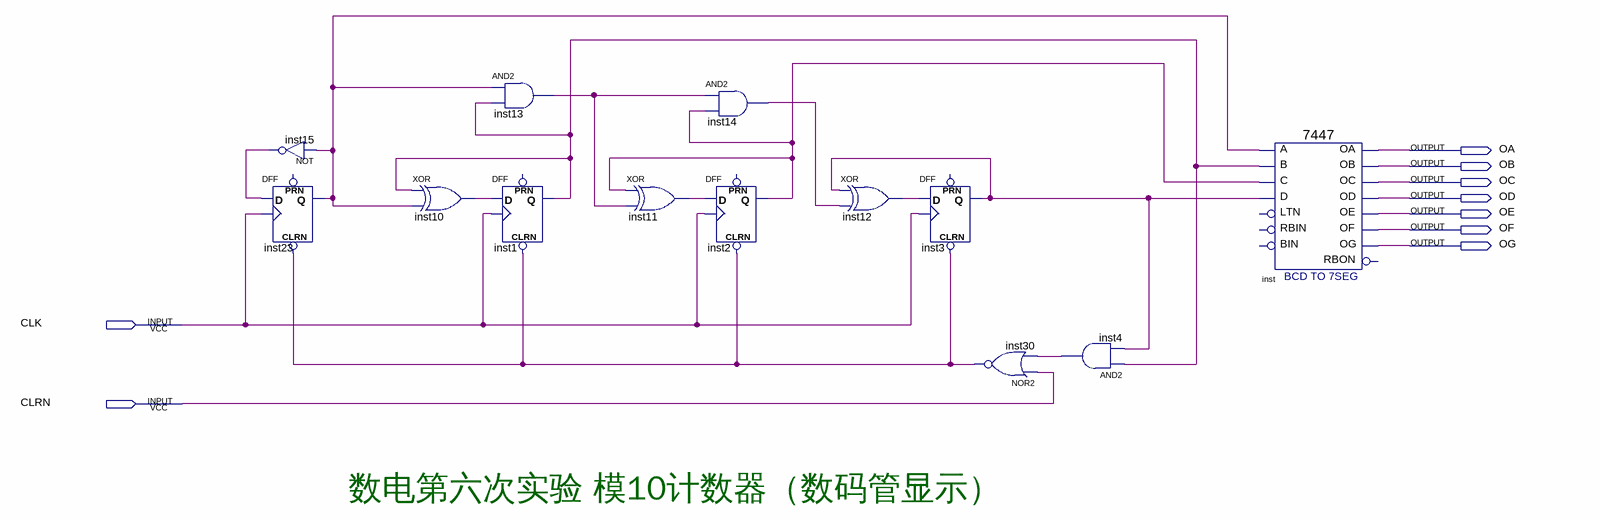
[diagram p0: schematic sheet]
// Quartus schematic DECjishuqi.bdf as structural Verilog: 13 symbols, 9 pins
module DECjishuqi (
  input  CLK,
  input  CLRN,
  output OA,
  output OB,
  output OC,
  output OD,
  output OE,
  output OF,
  output OG
);

  wire inst1_q, inst2_q, inst3_q, inst4_out, inst10_out, inst11_out, inst12_out, inst13_out, inst14_out,
       inst15_out, inst23_q, inst30_out;

  not inst15 (inst15_out, inst23_q);
  DFF inst23 (.CLRN(inst30_out), .CLK(CLK), .D(inst15_out), .Q(inst23_q));  // open: PRN
  xor inst10 (inst10_out, inst1_q, inst23_q);
  and inst13 (inst13_out, inst23_q, inst1_q);
  DFF inst1 (.CLRN(inst30_out), .CLK(CLK), .D(inst10_out), .Q(inst1_q));  // open: PRN
  xor inst11 (inst11_out, inst2_q, inst13_out);
  and inst14 (inst14_out, inst13_out, inst2_q);
  DFF inst2 (.CLRN(inst30_out), .CLK(CLK), .D(inst11_out), .Q(inst2_q));  // open: PRN
  xor inst12 (inst12_out, inst3_q, inst14_out);
  DFF inst3 (.CLRN(inst30_out), .CLK(CLK), .D(inst12_out), .Q(inst3_q));  // open: PRN
  nor inst30 (inst30_out, CLRN, inst4_out);
  and inst4 (inst4_out, inst1_q, inst3_q);
  \7447  inst (
    .B(inst1_q), .C(inst2_q), .D(inst3_q), .A(inst23_q), .OB(OB), .OC(OC), .OE(OE), .OD(OD), .OF(OF),
    .OG(OG), .OA(OA));  // open: LTN, RBIN, BIN, RBON

  // Notes on the sheet:
  //   数电第六次实验 模10计数器（数码管显示）
endmodule
